# EAGLE design 04B-357 (EAGLE 6.3)
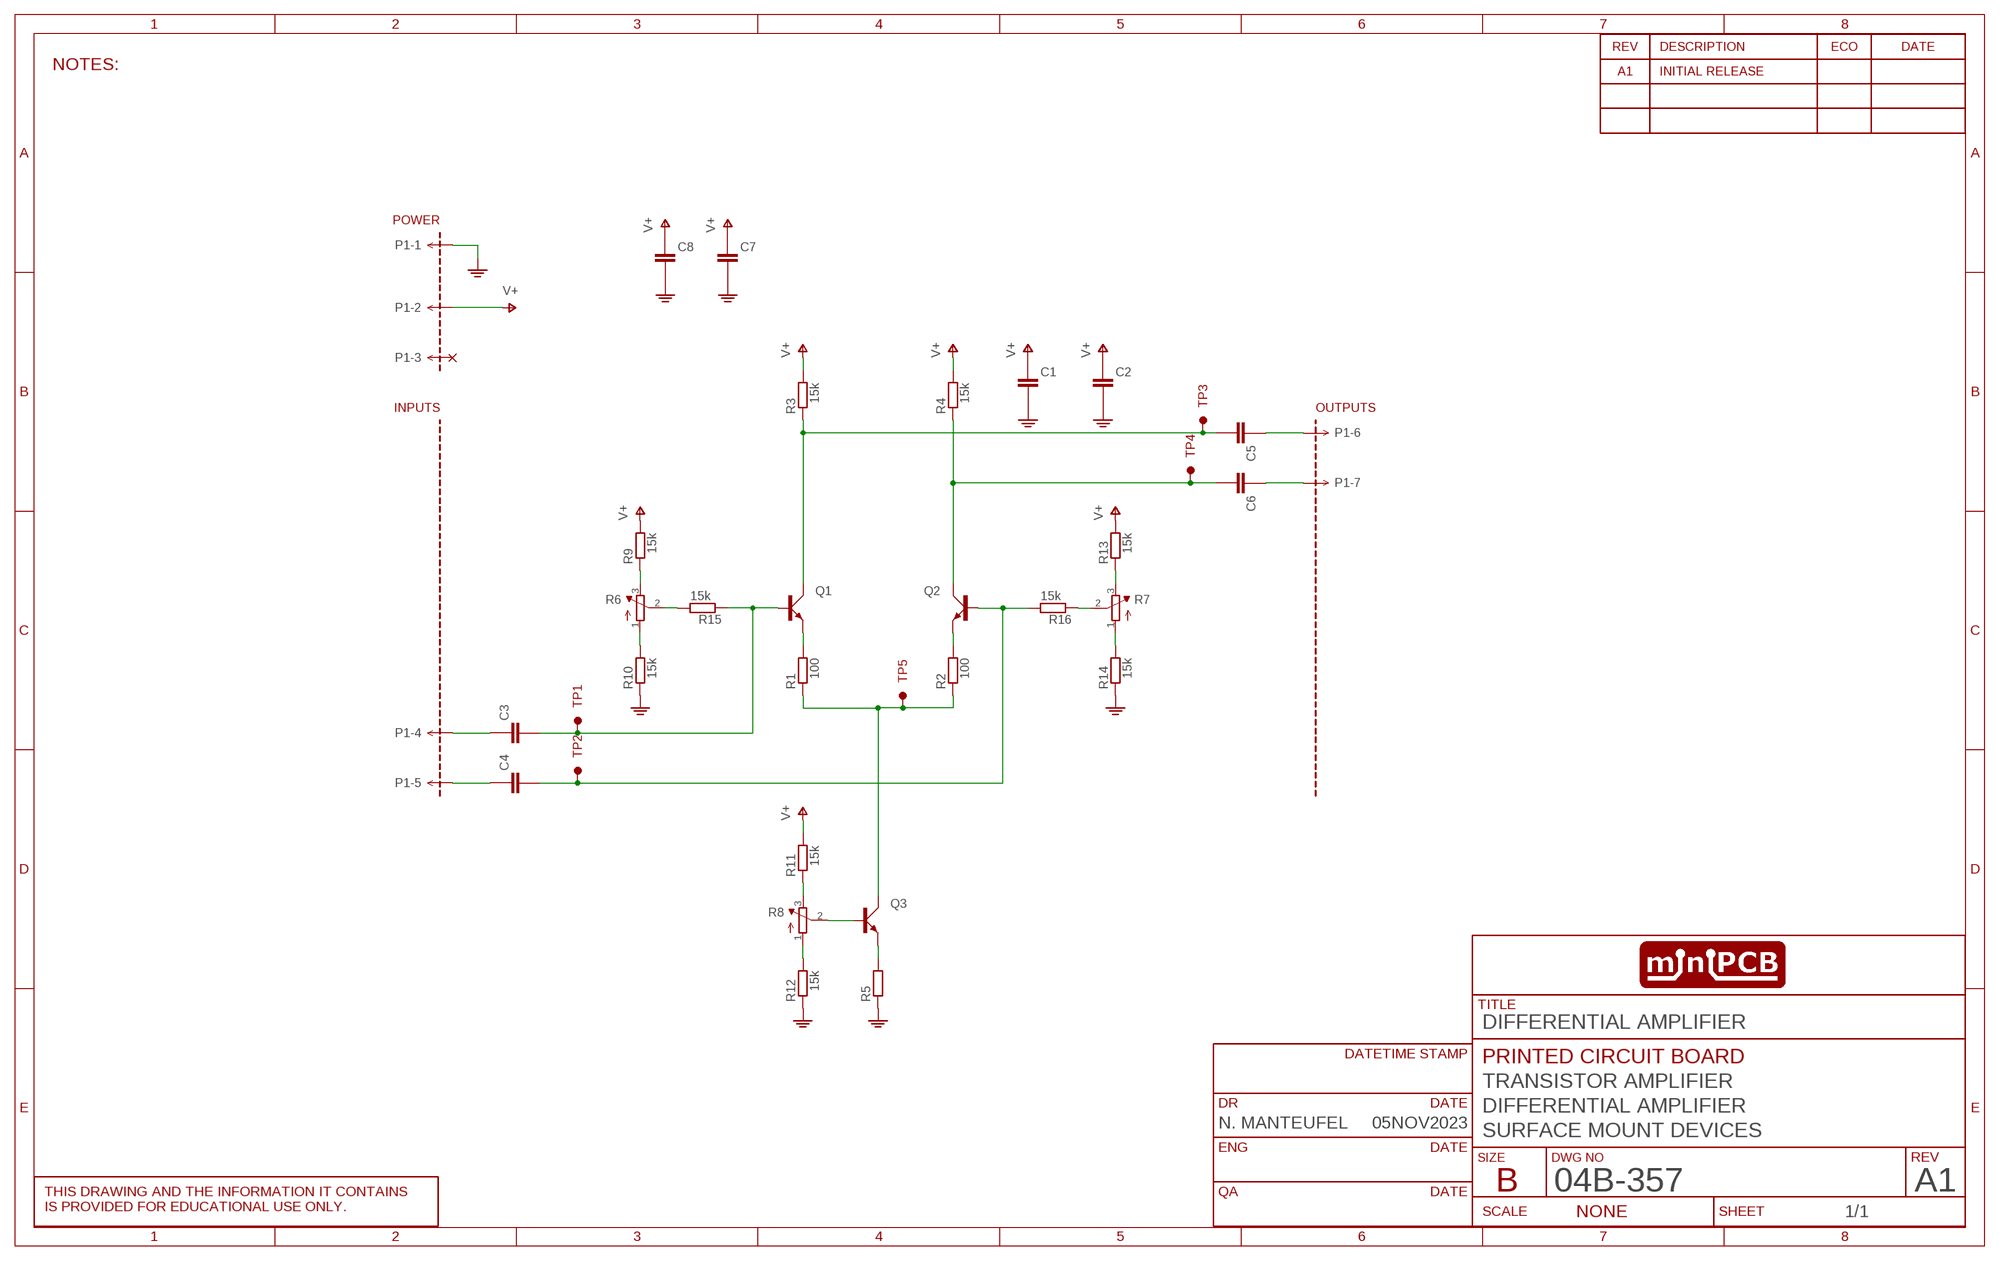
[diagram p0: schematic, sheet 1]
SHEET1 (SCHEMATIC): CIRCUIT_CATEGORY: TRANSISTOR AMPLIFIER; CIRCUIT_NAME: DIFFERENTIAL AMPLIFIER; CIRCUIT_VARIANT: SURFACE MOUNT DEVICES; DR: N. MANTEUFEL; DR_DATE: 05NOV2023; PCB_PCBA: PRINTED CIRCUIT BOARD; REVA: A1; REVISION: A1; TITLE: DIFFERENTIAL AMPLIFIER

## Parts
C1  CAPACITORSMD  [C0805]
C2  CAPACITORSMD  [C0805]
C3  CAPACITORSMD  [C0805]
C4  CAPACITORSMD  [C0805]
C5  CAPACITORSMD  [C0805]
C6  CAPACITORSMD  [C0805]
C7  CAPACITOR1206  [C1206]
C8  CAPACITOR1206  [C1206]
P1  MINIPCB_7P  [PINS_1X7]
PCB1  MINIPCB_0P25X50  [MINIPCB_0P_25X50]
Q1  BJT_NPNBEC  [SOT23]
Q2  BJT_NPNBEC  [SOT23]
Q3  BJT_NPNBEC  [SOT23]
R1  100  RESISTORSMD  [R0805]
R2  100  RESISTORSMD  [R0805]
R3  15k  RESISTORSMD  [R0805]
R4  15k  RESISTORSMD  [R0805]
R5  RESISTORSMD  [R0805]
R6  TRIMPOT0.100THD  [TRIM_0100]
R7  TRIMPOT0.100THD  [TRIM_0100]
R8  TRIMPOT0.100THD  [TRIM_0100]
R9  15k  RESISTORSMD  [R0805]
R10  15k  RESISTORSMD  [R0805]
R11  15k  RESISTORSMD  [R0805]
R12  15k  RESISTORSMD  [R0805]
R13  15k  RESISTORSMD  [R0805]
R14  15k  RESISTORSMD  [R0805]
R15  15k  RESISTORSMD  [R0805]
R16  15k  RESISTORSMD  [R0805]
TP1  TESTPOINTKE5000-SMTEXT  [PINS_1_TESTPOINT_KE5000_NOTEXT]
TP2  TESTPOINTKE5000-SMTEXT  [PINS_1_TESTPOINT_KE5000_NOTEXT]
TP3  TESTPOINTKE5000-SMTEXT  [PINS_1_TESTPOINT_KE5000_NOTEXT]
TP4  TESTPOINTKE5000-SMTEXT  [PINS_1_TESTPOINT_KE5000_NOTEXT]
TP5  TESTPOINTKE5000-SMTEXT  [PINS_1_TESTPOINT_KE5000_NOTEXT]

## Nets
GND: C1.2(-) C2.2(-) C7.- C8.- P1.1 R5.1 R10.1 R12.1 R14.1
N$1: Q3.3(C) R1.1 R2.1 TP5.1
N$2: C5.2(-) Q1.3(C) R3.1 TP3.1
N$3: Q1.2(E) R1.2
N$4: Q2.2(E) R2.2
N$5: C6.2(-) Q2.3(C) R4.1 TP4.1
N$6: Q3.2(E) R5.2
N$7: R8.3(E) R11.1
N$8: R8.1(A) R12.2
N$9: Q3.1(B) R8.2(S)
N$10: C3.2(-) Q1.1(B) R15.1 TP1.1
N$11: C4.2(-) Q2.1(B) R16.2 TP2.1
N$12: R7.3(E) R13.1
N$13: R7.1(A) R14.2
N$14: R6.3(E) R9.1
N$15: R6.1(A) R10.2
N$16: R6.2(S) R15.2
N$17: R7.2(S) R16.1
N$18: C3.1(+) P1.4
N$19: C4.1(+) P1.5
N$20: C5.1(+) P1.6
N$21: C6.1(+) P1.7
V+: C1.1(+) C2.1(+) C7.+ C8.+ P1.2 R3.2 R4.2 R9.2 R11.2 R13.2
Unconnected: P1.3

## Notes on the sheet
- NOTES:

## Library data of the parts
C1-C8 = minipcb:CAPACITOR
P1 = minipcb:MINIPCB_7P
PCB1 = minipcb:MINIPCB_0P; PART_NUMBER: 04B-357; REVISION: A1; TITLE: DIFFERENTIAL AMPLIFIER
Q1-Q3 = minipcb:BJT_NPN: TRANSISTOR
R1-R5 R9-R16 = minipcb:RESISTOR
R6-R8 = minipcb:TRIMPOT: SMT trimmer potentiometer part number TC33X http://www.ladyada.net/library/eagle
TP1-TP5 = minipcb:TESTPOINT

## Board
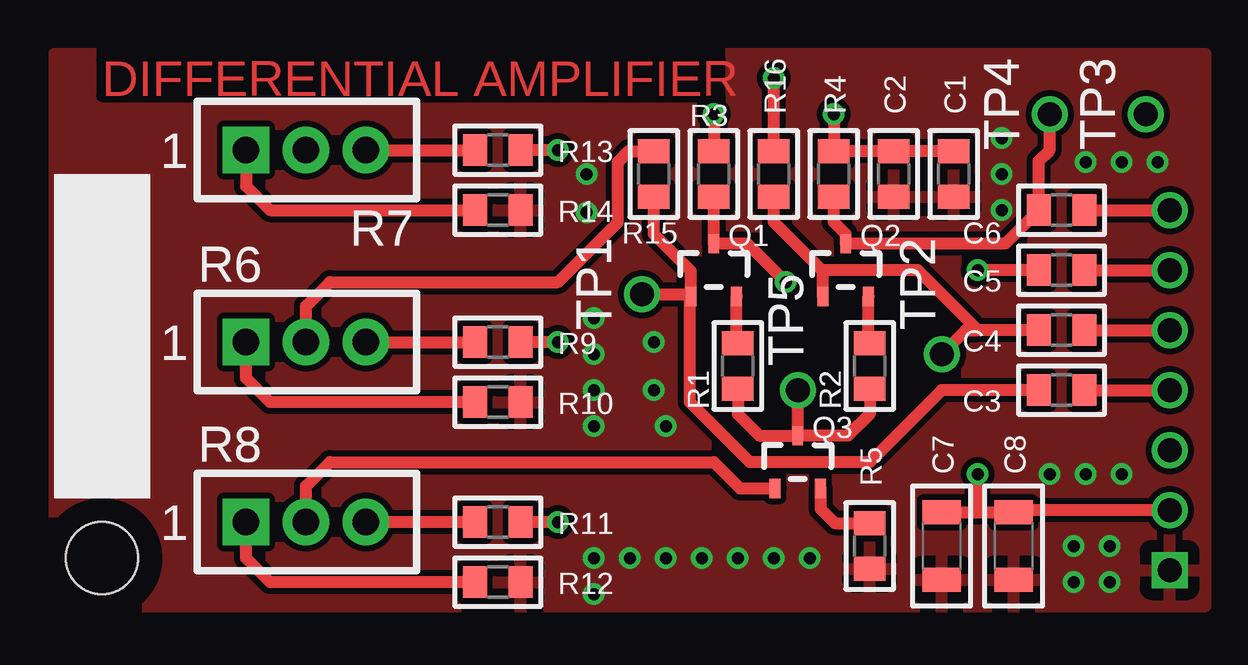
[diagram p1: board, top side]
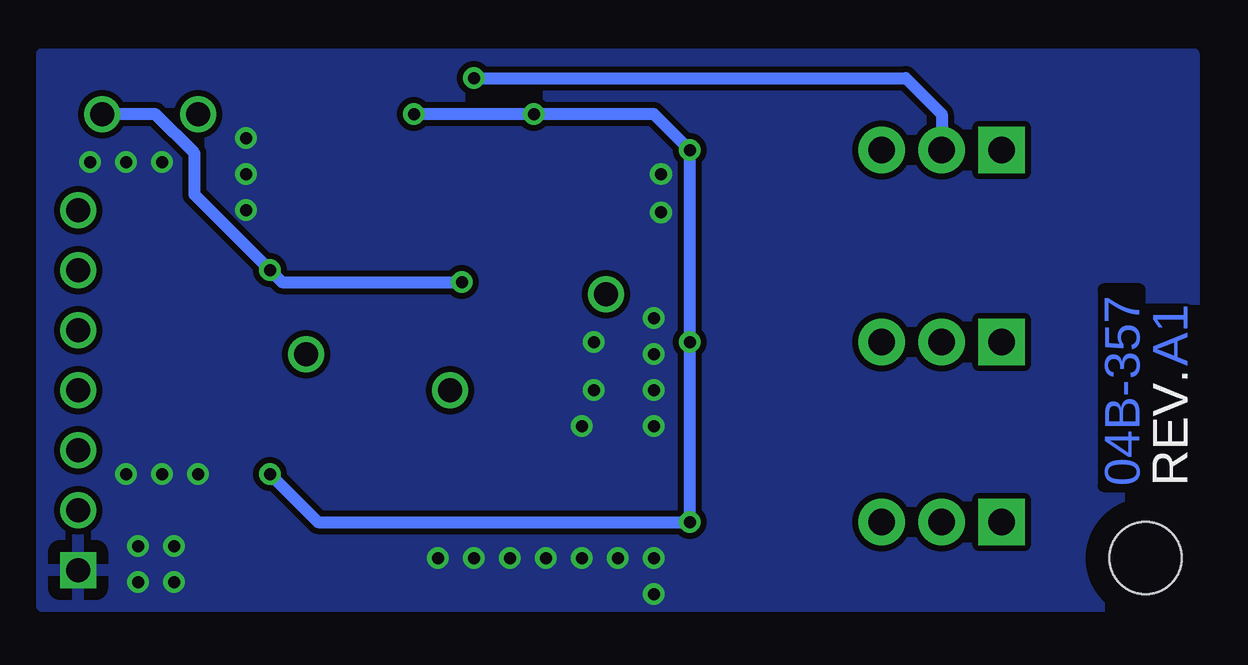
[diagram p2: board, bottom side, seen from below]

No outline drawn. Coordinates in mm, seen from the top.
Copper layers (1*16): Top 0.035mm / dielectric 1.5mm / Bottom 0.035mm
Design rules "minipcb": minimum track width 0.2mm, minimum drill 0.5mm, track to track 0.25mm, track to pad 0.5mm, pad to pad 0.5mm, via to via 0.5mm, smd to smd 0.15mm, copper to edge 1mm, drill to drill 1mm, minimum pad ring 0.2mm, minimum via ring 0.2mm, stop-mask expansion 0.1mm, vias tented up to drill 0.6mm, thermal gap 0.5mm

### Footprints (pad centres in the part's own frame; a part is rotated, then mirrored left to right if it is on the bottom)
C0805 = smd 1 x 1.3: 1 -0.95,0; 2 0.95,0
C1206 = smd 1 x 1.6: + -1.4,0; - 1.4,0
PINS_1X7 = drill 1 square: 1 0,0 | drill 1: 2 2.5,0; 3 5,0; 4 7.5,0; 5 10,0; 6 12.5,0; 7 15,0
MINIPCB_0P_25X50 = hole 3: 3,3
SOT23 = smd 0.45 x 0.8: 1 -0.95,-1.1; 2 0.95,-1.1; 3 0,1.1
R0805 = smd 1 x 1.3: 1 -0.95,0; 2 0.95,0
TRIM_0100 = drill 1.1 pad 1.93 square: 1 0,0 | drill 1.1 pad 1.93: 2 2.5,0; 3 5,0
PINS_1_TESTPOINT_KE5000_NOTEXT = drill 1: 1 0,0

### Placement (x,y rotation side)
C1  38.5,19 270 top
C2  36,19 270 top
C3  43,10 180 top
C4  43,12.5 180 top
C5  43,15 180 top
C6  43,17.5 180 top
C7  38,3.5 270 top
C8  41,3.5 270 top
P1  47.5,2.5 90 top
PCB1  0,0 0 top
Q1  28.5,15 0 top
Q2  34,15 0 top
Q3  32,7 0 top
R1  29.5,11 90 top
R2  35,11 90 top
R3  28.5,19 90 top
R4  33.5,19 90 top
R5  35,3.5 90 top
R6  9,12 0 top
R7  9,20 0 top
R8  9,4.5 0 top
R9  19.5,12 0 top
R10  19.5,9.5 180 top
R11  19.5,4.5 0 top
R12  19.5,2 180 top
R13  19.5,20 0 top
R14  19.5,17.5 180 top
R15  26,19 90 top
R16  31,19 270 top
TP1  25.5,14 90 top
TP2  38,11.5 0 top
TP3  46.5,21.5 90 top
TP4  42.5,21.5 90 top
TP5  32,10 90 top

### Tracks (layer width: path | path; a pad name or v marks a point on that pad's centre or on a via)
GND  (via drill 0.5)
  other vias: 40.5,17.5 40.5,19 40.5,20.5 23.2,19 23.2,17.4 23.5,11.5 23.5,10 23.5,8.5 23.5,3 23.5,1.5 25,3 26.5,3 28,3 29.5,3 31,3 32.5,3 43.5,3.5 43.5,2 45,3.5 45,2 45.5,6.5 44,6.5 42.5,6.5 26,12 26,10 26.5,8.5 23.5,13 44,19.5 45.5,19.5 47,19.5
  pour Top: 1,1 49,1 49,24 1,24
  pour Bottom: 1,1 49,1 49,24 1,24
N$1
  Top 0.5: R1.1 29.5,9 30.4,8.1 Q3.3 | R2.1 35,9 34.1,8.1 Q3.3 | Q3.3 TP5.1
N$2  (via drill 0.5)
  Top 0.5: R3.1 Q1.3 29.9,16.1 v31.5,14.5 | C5.2 v39.5,15
  Bottom 0.5: v31.5,14.5 39,14.5 v39.5,15 42.64,18.14 42.64,19.85 44.29,21.5 TP3.1
N$3
  Top 0.5: R1.2 29.45,12 Q1.2
N$4
  Top 0.5: R2.2 34.95,12 Q2.2
N$5
  Top 0.5: R4.1 33.5,17 34,16.5 Q2.3 40.65,16.1 C6.2 42.05,19.55 42.5,20 TP4.1
N$6
  Top 0.5: Q3.2 32.95,5.05 33.55,4.45 R5.2
N$7
  Top 0.5: R11.1 R8.3
N$8
  Top 0.5: R12.2 10,2 9,3 R8.1
N$9
  Top 0.5: R8.2 11.5,6 12.5,7 28.5,7 29.6,5.9 Q3.1
N$10
  Top 0.5: R15.1 26,16.5 27.55,14.95 Q1.1 27.5,13.85 | C3.2 38,10 35,7 30,7 27.5,9.5 27.5,13.85 | TP1.1 27.35,14 27.5,13.85
N$11
  Top 0.5: Q2.1 33.05,14.95 | R16.2 31,17 33.05,14.95 | C4.2 39.5,12.5 | 39.5,12.5 37,15 33.1,15 33.05,14.95 | TP2.1 39,12.5 39.5,12.5
N$12
  Top 0.5: R7.3 R13.1
N$13
  Top 0.5: R14.2 10,17.5 9,18.5 R7.1
N$14
  Top 0.5: R6.3 R9.1
N$15
  Top 0.5: R10.2 10,9.5 9,10.5 R6.1
N$16
  Top 0.5: R6.2 11.5,13.5 12.5,14.5 22,14.5 24.5,17 24.5,19.5 24.95,19.95 R15.2
N$17  (via drill 0.5)
  Top 0.5: R16.1 v31,23
  Bottom 0.5: v31,23 13,23 11.5,21.5 R7.2
N$18
  Top 0.5: C3.1 P1.4
N$19
  Top 0.5: C4.1 P1.5
N$20
  Top 0.5: C5.1 P1.6
N$21
  Top 0.5: C6.1 P1.7
V+  (via drill 0.5)
  Top 0.5: P1.2 41.1,5 C8.+ 39.5,4.9 | C7.+ 39.5,4.9 | 39.5,4.9 v39.5,6.5 | v22,4.5 R11.2 | v22,12 R9.2 | v22,20 R13.2 | v28.5,21.5 R3.2 | v33.5,21.5 R4.2 C2.1 C1.1
  Bottom 0.5: v39.5,6.5 37.5,4.5 v22,4.5 v22,12 v22,20 23.5,21.5 v28.5,21.5 v33.5,21.5

### Text on the board
_tNames: R16 | R4 | C2 | C1 | R3 | R13 | TP4 | TP3 | R7 | R14 | R15 | C6 | Q1 | Q2 | C5 | R6 | R9 | TP1 | TP2 | C4 | TP5 | C3 | R10 | R1 | R2 | Q3 | R8 | C7 | C8 | R5 | R11 | R12